# EAGLE schematic 00A-023 FRDM Protoboard (EAGLE 6.3)

## Sheet 1 of 2
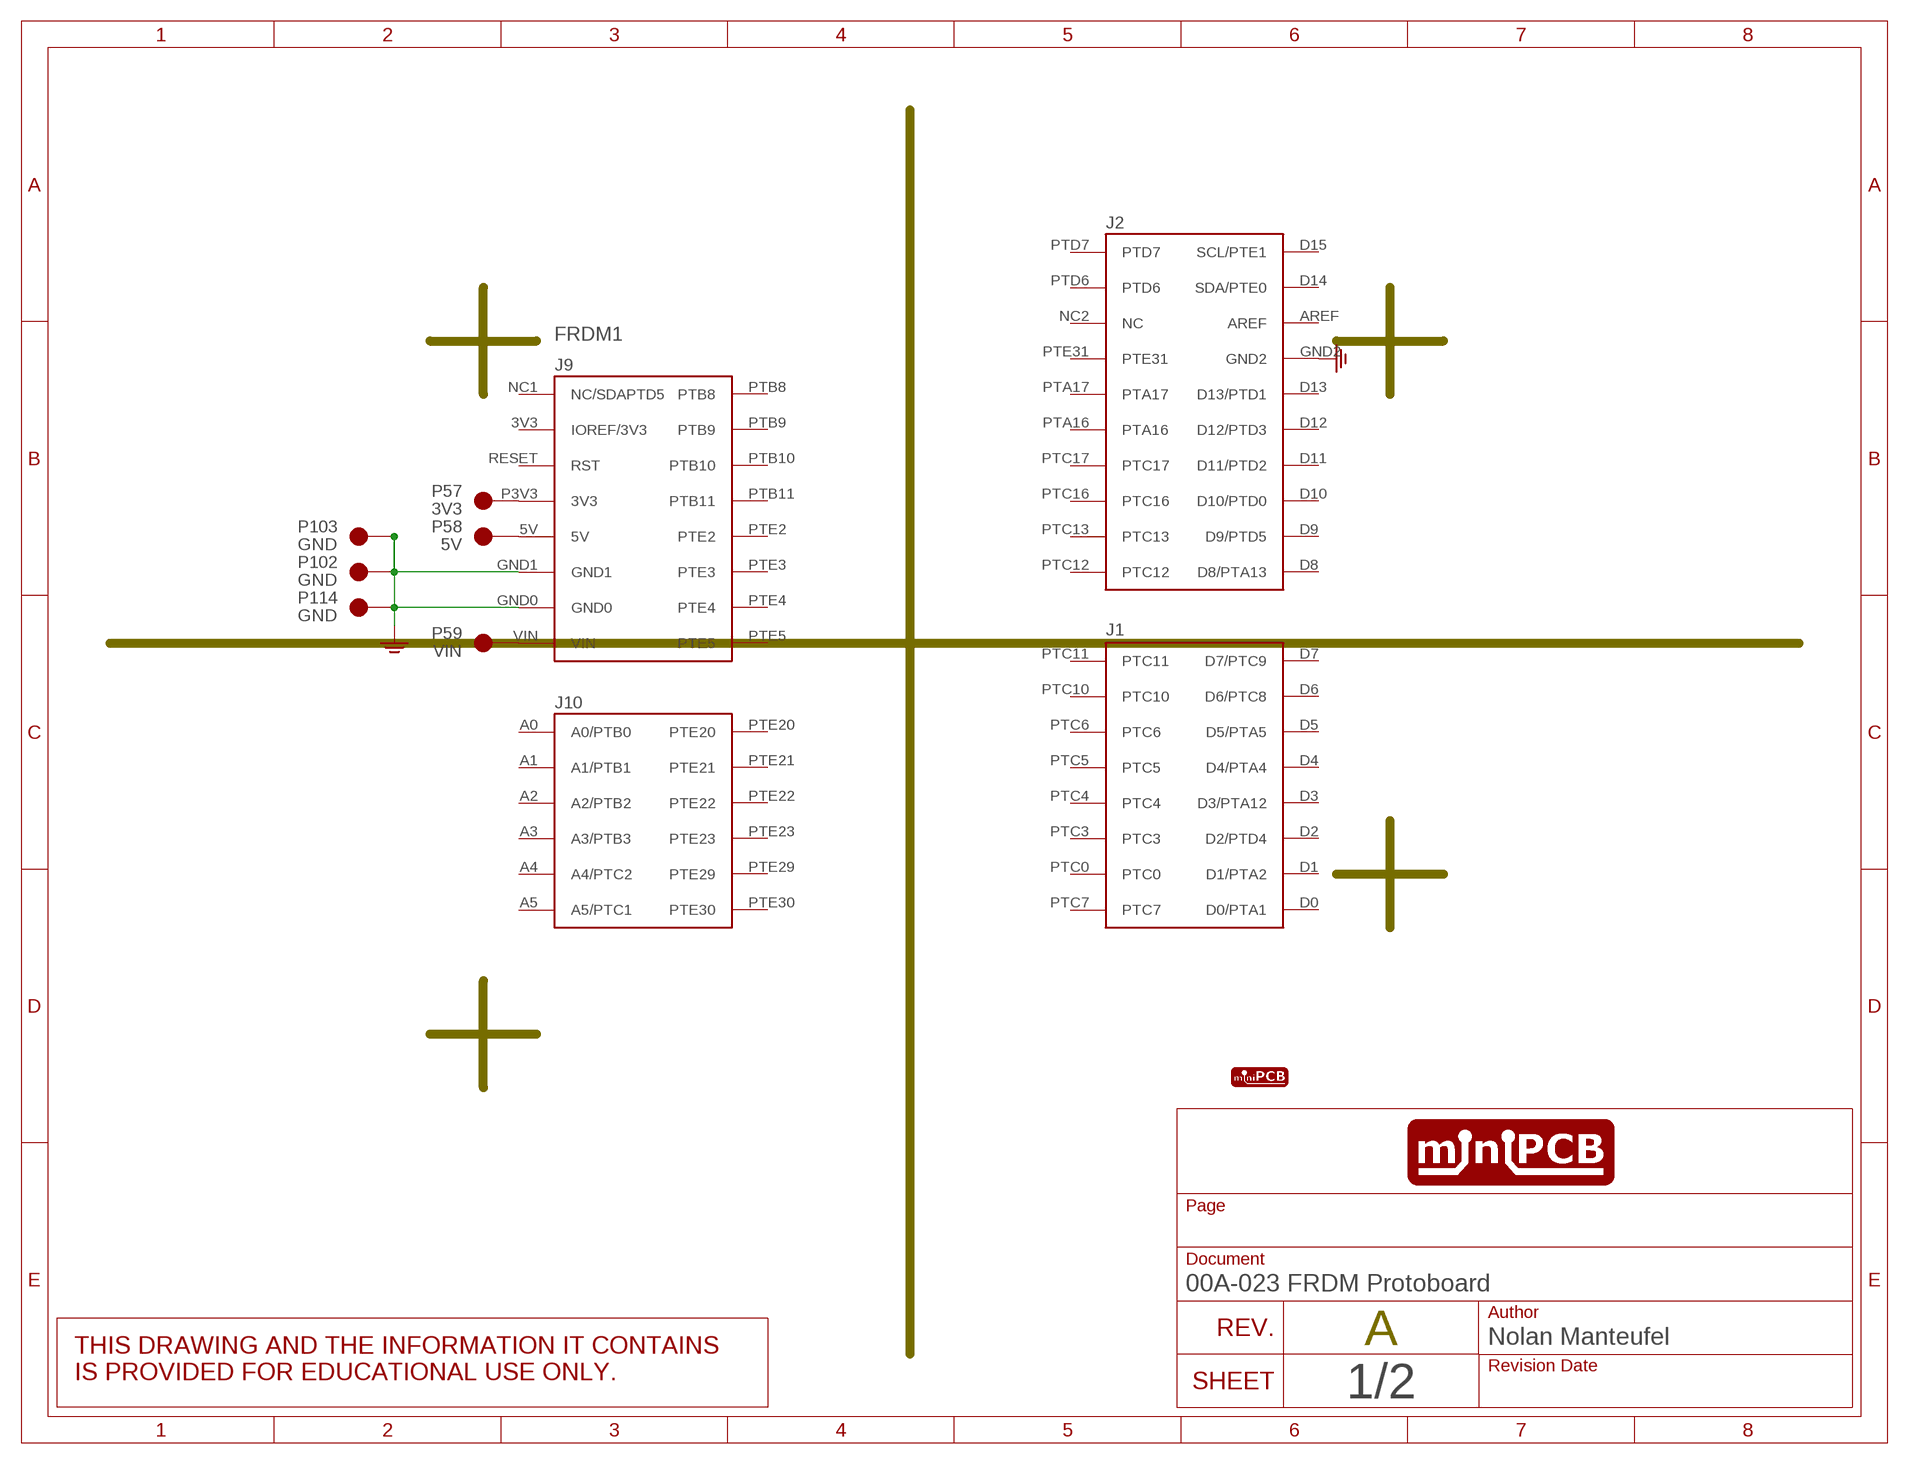
[diagram p0: schematic, sheet 1]

### Parts
FRDM1  FRDM-KL25ZNORMAL  [FRDM_KL25Z_NORMAL]
P57  3V3  PINS_13P_VALUE  [PINS_1-3P_VALUE]
P58  5V  PINS_13P_VALUE  [PINS_1-3P_VALUE]
P59  VIN  PINS_13P_VALUE  [PINS_1-3P_VALUE]
P102  GND  PINS_13P_VALUE  [PINS_1-3P_VALUE]
P103  GND  PINS_13P_VALUE  [PINS_1-3P_VALUE]
P114  GND  PINS_13P_VALUE  [PINS_1-3P_VALUE]
U$1  MINIPCB_LOGO  [MINIPCB-LOGO]

### Nets
GND: FRDM1.GND0 FRDM1.GND1 FRDM1.GND2 P102.1 P102.2 P102.3 P103.1 P103.2 P103.3 P114.1 P114.2 P114.3
N$57: FRDM1.P3V3(3V3) P57.1 P57.2 P57.3
N$58: FRDM1.5V P58.1 P58.2 P58.3
N$59: FRDM1.VIN P59.1 P59.2 P59.3
Unconnected: FRDM1.3V3(IOREF/3V3) FRDM1.A0(A0/PTB0) FRDM1.A1(A1/PTB1) FRDM1.A2(A2/PTB2) FRDM1.A3(A3/PTB3) FRDM1.A4(A4/PTC2) FRDM1.A5(A5/PTC1) FRDM1.AREF FRDM1.D0(D0/PTA1) FRDM1.D1(D1/PTA2) FRDM1.D2(D2/PTD4) FRDM1.D3(D3/PTA12) FRDM1.D4(D4/PTA4) FRDM1.D5(D5/PTA5) FRDM1.D6(D6/PTC8) FRDM1.D7(D7/PTC9) FRDM1.D8(D8/PTA13) FRDM1.D9(D9/PTD5) FRDM1.D10(D10/PTD0) FRDM1.D11(D11/PTD2) FRDM1.D12(D12/PTD3) FRDM1.D13(D13/PTD1) FRDM1.D14(SDA/PTE0) FRDM1.D15(SCL/PTE1) FRDM1.NC1(NC/SDAPTD5) FRDM1.NC2(NC) FRDM1.PTA16 FRDM1.PTA17 FRDM1.PTB8 FRDM1.PTB9 FRDM1.PTB10 FRDM1.PTB11 FRDM1.PTC0 FRDM1.PTC3 FRDM1.PTC4 FRDM1.PTC5 FRDM1.PTC6 FRDM1.PTC7 FRDM1.PTC10 FRDM1.PTC11 FRDM1.PTC12 FRDM1.PTC13 FRDM1.PTC16 FRDM1.PTC17 FRDM1.PTD6 FRDM1.PTD7 FRDM1.PTE2 FRDM1.PTE3 FRDM1.PTE4 FRDM1.PTE5 FRDM1.PTE20 FRDM1.PTE21 FRDM1.PTE22 FRDM1.PTE23 FRDM1.PTE29 FRDM1.PTE30 FRDM1.PTE31 FRDM1.RESET(RST)

## Sheet 2 of 2
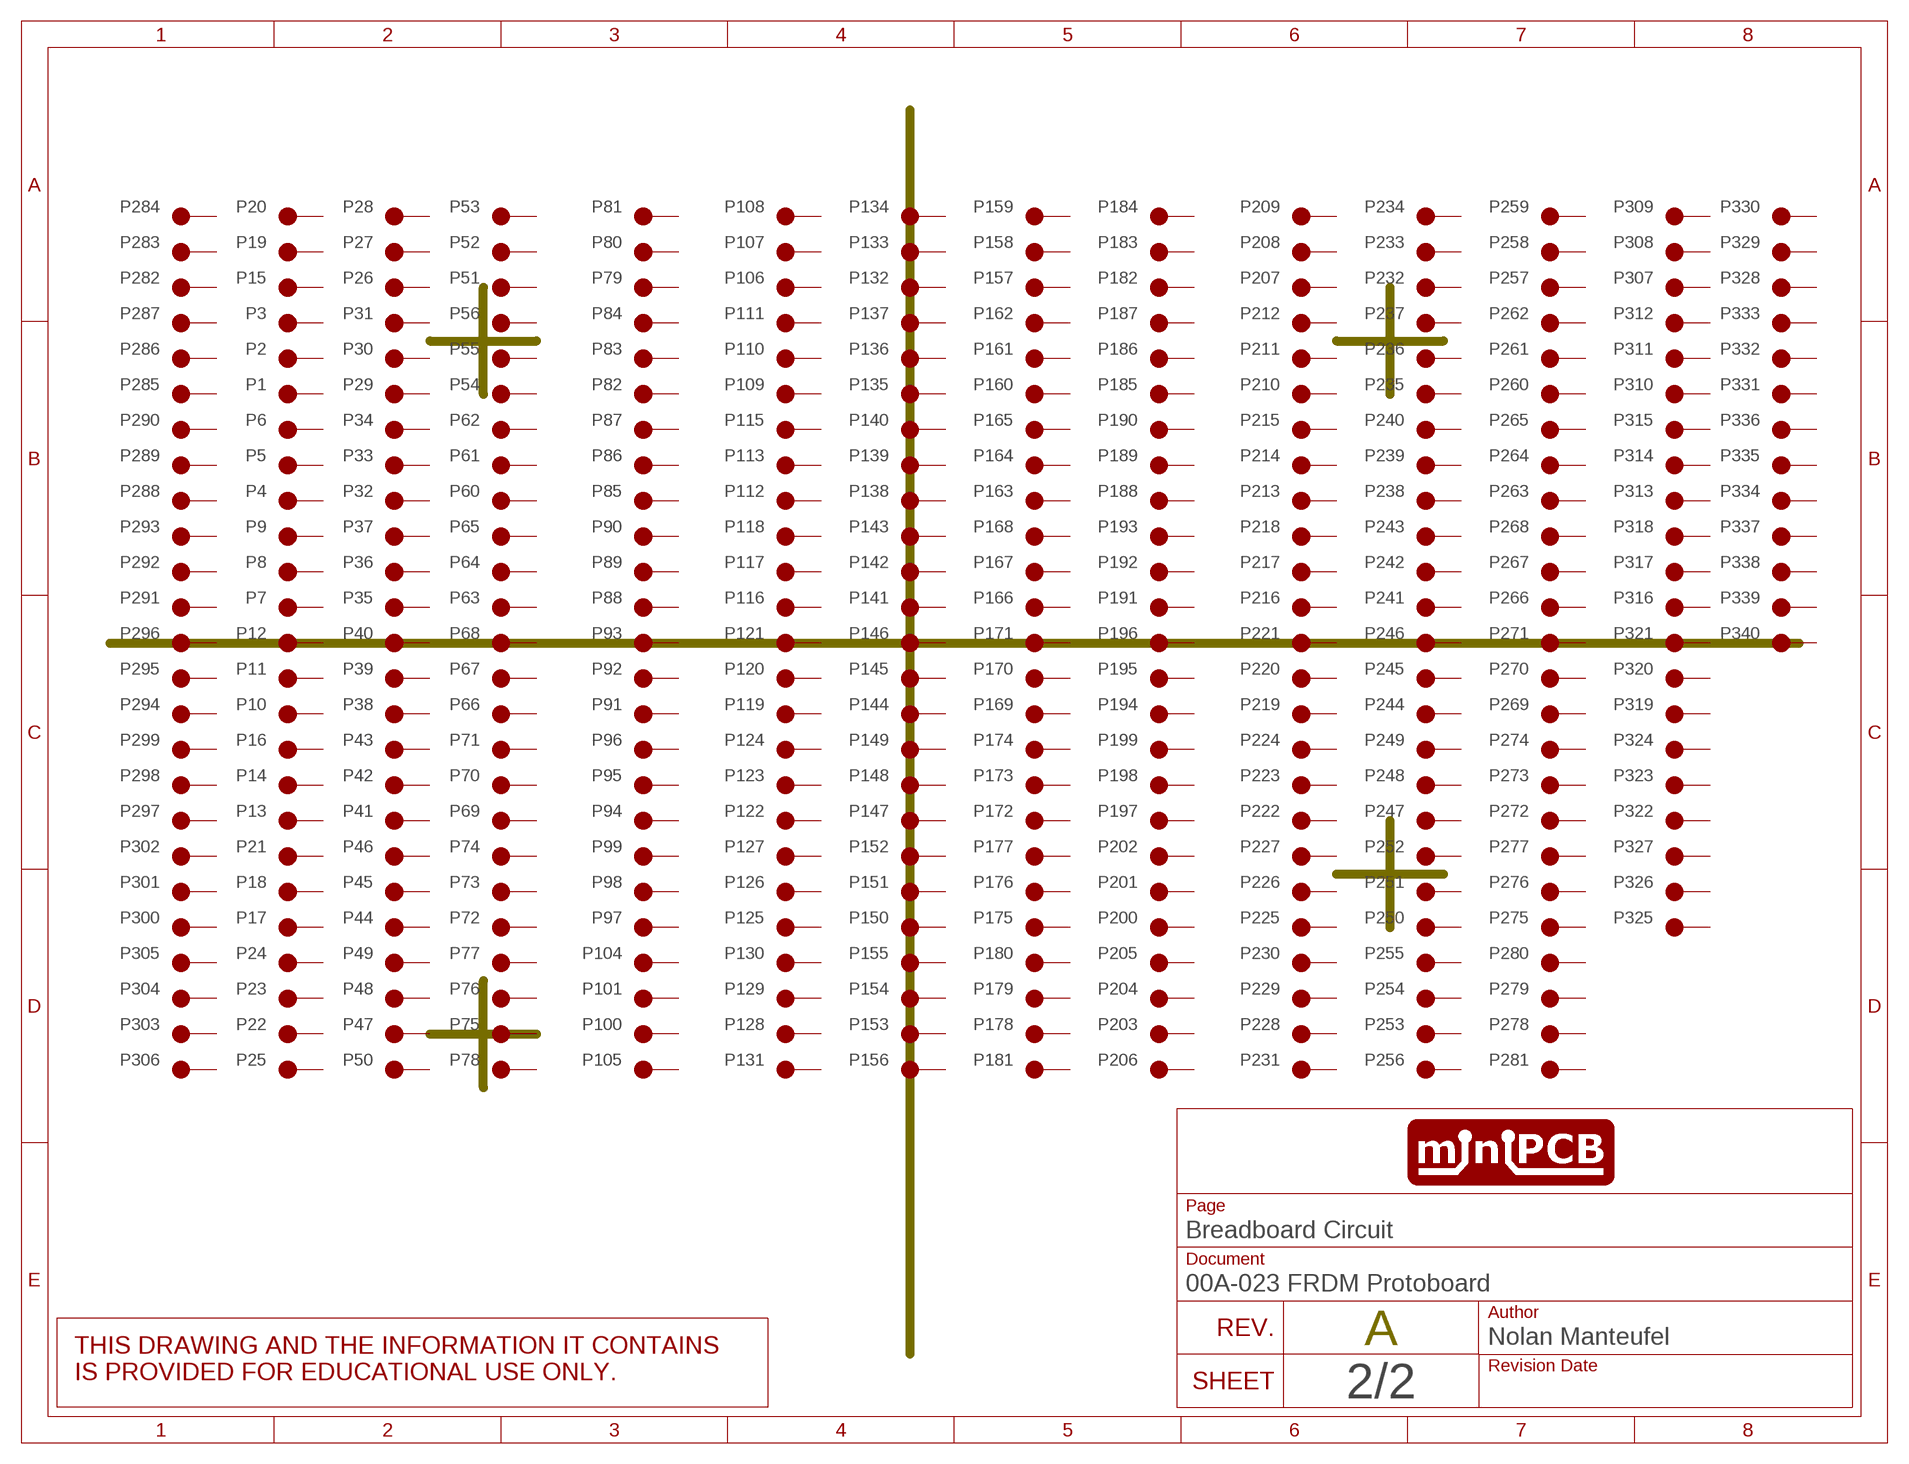
[diagram p1: schematic, sheet 2]

### Parts
P1  PINS_11P_VALUE  [PINS_1-1P_VALUE]
P2  PINS_11P_VALUE  [PINS_1-1P_VALUE]
P3  PINS_11P_VALUE  [PINS_1-1P_VALUE]
P4  PINS_11P_VALUE  [PINS_1-1P_VALUE]
P5  PINS_11P_VALUE  [PINS_1-1P_VALUE]
P6  PINS_11P_VALUE  [PINS_1-1P_VALUE]
P7  PINS_11P_VALUE  [PINS_1-1P_VALUE]
P8  PINS_11P_VALUE  [PINS_1-1P_VALUE]
P9  PINS_11P_VALUE  [PINS_1-1P_VALUE]
P10  PINS_11P_VALUE  [PINS_1-1P_VALUE]
P11  PINS_11P_VALUE  [PINS_1-1P_VALUE]
P12  PINS_11P_VALUE  [PINS_1-1P_VALUE]
P13  PINS_11P_VALUE  [PINS_1-1P_VALUE]
P14  PINS_11P_VALUE  [PINS_1-1P_VALUE]
P15  PINS_11P_VALUE  [PINS_1-1P_VALUE]
P16  PINS_11P_VALUE  [PINS_1-1P_VALUE]
P17  PINS_11P_VALUE  [PINS_1-1P_VALUE]
P18  PINS_11P_VALUE  [PINS_1-1P_VALUE]
P19  PINS_11P_VALUE  [PINS_1-1P_VALUE]
P20  PINS_11P_VALUE  [PINS_1-1P_VALUE]
P21  PINS_11P_VALUE  [PINS_1-1P_VALUE]
P22  PINS_11P_VALUE  [PINS_1-1P_VALUE]
P23  PINS_11P_VALUE  [PINS_1-1P_VALUE]
P24  PINS_11P_VALUE  [PINS_1-1P_VALUE]
P25  PINS_11P_VALUE  [PINS_1-1P_VALUE]
P26  PINS_11P_VALUE  [PINS_1-1P_VALUE]
P27  PINS_11P_VALUE  [PINS_1-1P_VALUE]
P28  PINS_11P_VALUE  [PINS_1-1P_VALUE]
P29  PINS_11P_VALUE  [PINS_1-1P_VALUE]
P30  PINS_11P_VALUE  [PINS_1-1P_VALUE]
P31  PINS_11P_VALUE  [PINS_1-1P_VALUE]
P32  PINS_11P_VALUE  [PINS_1-1P_VALUE]
P33  PINS_11P_VALUE  [PINS_1-1P_VALUE]
P34  PINS_11P_VALUE  [PINS_1-1P_VALUE]
P35  PINS_11P_VALUE  [PINS_1-1P_VALUE]
P36  PINS_11P_VALUE  [PINS_1-1P_VALUE]
P37  PINS_11P_VALUE  [PINS_1-1P_VALUE]
P38  PINS_11P_VALUE  [PINS_1-1P_VALUE]
P39  PINS_11P_VALUE  [PINS_1-1P_VALUE]
P40  PINS_11P_VALUE  [PINS_1-1P_VALUE]
P41  PINS_11P_VALUE  [PINS_1-1P_VALUE]
P42  PINS_11P_VALUE  [PINS_1-1P_VALUE]
P43  PINS_11P_VALUE  [PINS_1-1P_VALUE]
P44  PINS_11P_VALUE  [PINS_1-1P_VALUE]
P45  PINS_11P_VALUE  [PINS_1-1P_VALUE]
P46  PINS_11P_VALUE  [PINS_1-1P_VALUE]
P47  PINS_11P_VALUE  [PINS_1-1P_VALUE]
P48  PINS_11P_VALUE  [PINS_1-1P_VALUE]
P49  PINS_11P_VALUE  [PINS_1-1P_VALUE]
P50  PINS_11P_VALUE  [PINS_1-1P_VALUE]
P51  PINS_11P_VALUE  [PINS_1-1P_VALUE]
P52  PINS_11P_VALUE  [PINS_1-1P_VALUE]
P53  PINS_11P_VALUE  [PINS_1-1P_VALUE]
P54  PINS_11P_VALUE  [PINS_1-1P_VALUE]
P55  PINS_11P_VALUE  [PINS_1-1P_VALUE]
P56  PINS_11P_VALUE  [PINS_1-1P_VALUE]
P60  PINS_11P_VALUE  [PINS_1-1P_VALUE]
P61  PINS_11P_VALUE  [PINS_1-1P_VALUE]
P62  PINS_11P_VALUE  [PINS_1-1P_VALUE]
P63  PINS_11P_VALUE  [PINS_1-1P_VALUE]
P64  PINS_11P_VALUE  [PINS_1-1P_VALUE]
P65  PINS_11P_VALUE  [PINS_1-1P_VALUE]
P66  PINS_11P_VALUE  [PINS_1-1P_VALUE]
P67  PINS_11P_VALUE  [PINS_1-1P_VALUE]
P68  PINS_11P_VALUE  [PINS_1-1P_VALUE]
P69  PINS_11P_VALUE  [PINS_1-1P_VALUE]
P70  PINS_11P_VALUE  [PINS_1-1P_VALUE]
P71  PINS_11P_VALUE  [PINS_1-1P_VALUE]
P72  PINS_11P_VALUE  [PINS_1-1P_VALUE]
P73  PINS_11P_VALUE  [PINS_1-1P_VALUE]
P74  PINS_11P_VALUE  [PINS_1-1P_VALUE]
P75  PINS_11P_VALUE  [PINS_1-1P_VALUE]
P76  PINS_11P_VALUE  [PINS_1-1P_VALUE]
P77  PINS_11P_VALUE  [PINS_1-1P_VALUE]
P78  PINS_11P_VALUE  [PINS_1-1P_VALUE]
P79  PINS_11P_VALUE  [PINS_1-1P_VALUE]
P80  PINS_11P_VALUE  [PINS_1-1P_VALUE]
P81  PINS_11P_VALUE  [PINS_1-1P_VALUE]
P82  PINS_11P_VALUE  [PINS_1-1P_VALUE]
P83  PINS_11P_VALUE  [PINS_1-1P_VALUE]
P84  PINS_11P_VALUE  [PINS_1-1P_VALUE]
P85  PINS_11P_VALUE  [PINS_1-1P_VALUE]
P86  PINS_11P_VALUE  [PINS_1-1P_VALUE]
P87  PINS_11P_VALUE  [PINS_1-1P_VALUE]
P88  PINS_11P_VALUE  [PINS_1-1P_VALUE]
P89  PINS_11P_VALUE  [PINS_1-1P_VALUE]
P90  PINS_11P_VALUE  [PINS_1-1P_VALUE]
P91  PINS_11P_VALUE  [PINS_1-1P_VALUE]
P92  PINS_11P_VALUE  [PINS_1-1P_VALUE]
P93  PINS_11P_VALUE  [PINS_1-1P_VALUE]
P94  PINS_11P_VALUE  [PINS_1-1P_VALUE]
P95  PINS_11P_VALUE  [PINS_1-1P_VALUE]
P96  PINS_11P_VALUE  [PINS_1-1P_VALUE]
P97  PINS_11P_VALUE  [PINS_1-1P_VALUE]
P98  PINS_11P_VALUE  [PINS_1-1P_VALUE]
P99  PINS_11P_VALUE  [PINS_1-1P_VALUE]
P100  PINS_11P_VALUE  [PINS_1-1P_VALUE]
P101  PINS_11P_VALUE  [PINS_1-1P_VALUE]
P104  PINS_11P_VALUE  [PINS_1-1P_VALUE]
P105  PINS_11P_VALUE  [PINS_1-1P_VALUE]
P106  PINS_11P_VALUE  [PINS_1-1P_VALUE]
P107  PINS_11P_VALUE  [PINS_1-1P_VALUE]
P108  PINS_11P_VALUE  [PINS_1-1P_VALUE]
P109  PINS_11P_VALUE  [PINS_1-1P_VALUE]
P110  PINS_11P_VALUE  [PINS_1-1P_VALUE]
P111  PINS_11P_VALUE  [PINS_1-1P_VALUE]
P112  PINS_11P_VALUE  [PINS_1-1P_VALUE]
P113  PINS_11P_VALUE  [PINS_1-1P_VALUE]
P115  PINS_11P_VALUE  [PINS_1-1P_VALUE]
P116  PINS_11P_VALUE  [PINS_1-1P_VALUE]
P117  PINS_11P_VALUE  [PINS_1-1P_VALUE]
P118  PINS_11P_VALUE  [PINS_1-1P_VALUE]
P119  PINS_11P_VALUE  [PINS_1-1P_VALUE]
P120  PINS_11P_VALUE  [PINS_1-1P_VALUE]
P121  PINS_11P_VALUE  [PINS_1-1P_VALUE]
P122  PINS_11P_VALUE  [PINS_1-1P_VALUE]
P123  PINS_11P_VALUE  [PINS_1-1P_VALUE]
P124  PINS_11P_VALUE  [PINS_1-1P_VALUE]
P125  PINS_11P_VALUE  [PINS_1-1P_VALUE]
P126  PINS_11P_VALUE  [PINS_1-1P_VALUE]
P127  PINS_11P_VALUE  [PINS_1-1P_VALUE]
P128  PINS_11P_VALUE  [PINS_1-1P_VALUE]
P129  PINS_11P_VALUE  [PINS_1-1P_VALUE]
P130  PINS_11P_VALUE  [PINS_1-1P_VALUE]
P131  PINS_11P_VALUE  [PINS_1-1P_VALUE]
P132  PINS_11P_VALUE  [PINS_1-1P_VALUE]
P133  PINS_11P_VALUE  [PINS_1-1P_VALUE]
P134  PINS_11P_VALUE  [PINS_1-1P_VALUE]
P135  PINS_11P_VALUE  [PINS_1-1P_VALUE]
P136  PINS_11P_VALUE  [PINS_1-1P_VALUE]
P137  PINS_11P_VALUE  [PINS_1-1P_VALUE]
P138  PINS_11P_VALUE  [PINS_1-1P_VALUE]
P139  PINS_11P_VALUE  [PINS_1-1P_VALUE]
P140  PINS_11P_VALUE  [PINS_1-1P_VALUE]
P141  PINS_11P_VALUE  [PINS_1-1P_VALUE]
P142  PINS_11P_VALUE  [PINS_1-1P_VALUE]
P143  PINS_11P_VALUE  [PINS_1-1P_VALUE]
P144  PINS_11P_VALUE  [PINS_1-1P_VALUE]
P145  PINS_11P_VALUE  [PINS_1-1P_VALUE]
P146  PINS_11P_VALUE  [PINS_1-1P_VALUE]
P147  PINS_11P_VALUE  [PINS_1-1P_VALUE]
P148  PINS_11P_VALUE  [PINS_1-1P_VALUE]
P149  PINS_11P_VALUE  [PINS_1-1P_VALUE]
P150  PINS_11P_VALUE  [PINS_1-1P_VALUE]
P151  PINS_11P_VALUE  [PINS_1-1P_VALUE]
P152  PINS_11P_VALUE  [PINS_1-1P_VALUE]
P153  PINS_11P_VALUE  [PINS_1-1P_VALUE]
P154  PINS_11P_VALUE  [PINS_1-1P_VALUE]
P155  PINS_11P_VALUE  [PINS_1-1P_VALUE]
P156  PINS_11P_VALUE  [PINS_1-1P_VALUE]
P157  PINS_11P_VALUE  [PINS_1-1P_VALUE]
P158  PINS_11P_VALUE  [PINS_1-1P_VALUE]
P159  PINS_11P_VALUE  [PINS_1-1P_VALUE]
P160  PINS_11P_VALUE  [PINS_1-1P_VALUE]
P161  PINS_11P_VALUE  [PINS_1-1P_VALUE]
P162  PINS_11P_VALUE  [PINS_1-1P_VALUE]
P163  PINS_11P_VALUE  [PINS_1-1P_VALUE]
P164  PINS_11P_VALUE  [PINS_1-1P_VALUE]
P165  PINS_11P_VALUE  [PINS_1-1P_VALUE]
P166  PINS_11P_VALUE  [PINS_1-1P_VALUE]
P167  PINS_11P_VALUE  [PINS_1-1P_VALUE]
P168  PINS_11P_VALUE  [PINS_1-1P_VALUE]
P169  PINS_11P_VALUE  [PINS_1-1P_VALUE]
P170  PINS_11P_VALUE  [PINS_1-1P_VALUE]
P171  PINS_11P_VALUE  [PINS_1-1P_VALUE]
P172  PINS_11P_VALUE  [PINS_1-1P_VALUE]
P173  PINS_11P_VALUE  [PINS_1-1P_VALUE]
P174  PINS_11P_VALUE  [PINS_1-1P_VALUE]
P175  PINS_11P_VALUE  [PINS_1-1P_VALUE]
P176  PINS_11P_VALUE  [PINS_1-1P_VALUE]
P177  PINS_11P_VALUE  [PINS_1-1P_VALUE]
P178  PINS_11P_VALUE  [PINS_1-1P_VALUE]
P179  PINS_11P_VALUE  [PINS_1-1P_VALUE]
P180  PINS_11P_VALUE  [PINS_1-1P_VALUE]
P181  PINS_11P_VALUE  [PINS_1-1P_VALUE]
P182  PINS_11P_VALUE  [PINS_1-1P_VALUE]
P183  PINS_11P_VALUE  [PINS_1-1P_VALUE]
P184  PINS_11P_VALUE  [PINS_1-1P_VALUE]
P185  PINS_11P_VALUE  [PINS_1-1P_VALUE]
P186  PINS_11P_VALUE  [PINS_1-1P_VALUE]
P187  PINS_11P_VALUE  [PINS_1-1P_VALUE]
P188  PINS_11P_VALUE  [PINS_1-1P_VALUE]
P189  PINS_11P_VALUE  [PINS_1-1P_VALUE]
P190  PINS_11P_VALUE  [PINS_1-1P_VALUE]
P191  PINS_11P_VALUE  [PINS_1-1P_VALUE]
P192  PINS_11P_VALUE  [PINS_1-1P_VALUE]
P193  PINS_11P_VALUE  [PINS_1-1P_VALUE]
P194  PINS_11P_VALUE  [PINS_1-1P_VALUE]
P195  PINS_11P_VALUE  [PINS_1-1P_VALUE]
P196  PINS_11P_VALUE  [PINS_1-1P_VALUE]
P197  PINS_11P_VALUE  [PINS_1-1P_VALUE]
P198  PINS_11P_VALUE  [PINS_1-1P_VALUE]
P199  PINS_11P_VALUE  [PINS_1-1P_VALUE]
P200  PINS_11P_VALUE  [PINS_1-1P_VALUE]
P201  PINS_11P_VALUE  [PINS_1-1P_VALUE]
P202  PINS_11P_VALUE  [PINS_1-1P_VALUE]
P203  PINS_11P_VALUE  [PINS_1-1P_VALUE]
P204  PINS_11P_VALUE  [PINS_1-1P_VALUE]
P205  PINS_11P_VALUE  [PINS_1-1P_VALUE]
P206  PINS_11P_VALUE  [PINS_1-1P_VALUE]
P207  PINS_11P_VALUE  [PINS_1-1P_VALUE]
P208  PINS_11P_VALUE  [PINS_1-1P_VALUE]
P209  PINS_11P_VALUE  [PINS_1-1P_VALUE]
P210  PINS_11P_VALUE  [PINS_1-1P_VALUE]
P211  PINS_11P_VALUE  [PINS_1-1P_VALUE]
P212  PINS_11P_VALUE  [PINS_1-1P_VALUE]
P213  PINS_11P_VALUE  [PINS_1-1P_VALUE]
P214  PINS_11P_VALUE  [PINS_1-1P_VALUE]
P215  PINS_11P_VALUE  [PINS_1-1P_VALUE]
P216  PINS_11P_VALUE  [PINS_1-1P_VALUE]
P217  PINS_11P_VALUE  [PINS_1-1P_VALUE]
P218  PINS_11P_VALUE  [PINS_1-1P_VALUE]
P219  PINS_11P_VALUE  [PINS_1-1P_VALUE]
P220  PINS_11P_VALUE  [PINS_1-1P_VALUE]
P221  PINS_11P_VALUE  [PINS_1-1P_VALUE]
P222  PINS_11P_VALUE  [PINS_1-1P_VALUE]
P223  PINS_11P_VALUE  [PINS_1-1P_VALUE]
P224  PINS_11P_VALUE  [PINS_1-1P_VALUE]
P225  PINS_11P_VALUE  [PINS_1-1P_VALUE]
P226  PINS_11P_VALUE  [PINS_1-1P_VALUE]
P227  PINS_11P_VALUE  [PINS_1-1P_VALUE]
P228  PINS_11P_VALUE  [PINS_1-1P_VALUE]
P229  PINS_11P_VALUE  [PINS_1-1P_VALUE]
P230  PINS_11P_VALUE  [PINS_1-1P_VALUE]
P231  PINS_11P_VALUE  [PINS_1-1P_VALUE]
P232  PINS_11P_VALUE  [PINS_1-1P_VALUE]
P233  PINS_11P_VALUE  [PINS_1-1P_VALUE]
P234  PINS_11P_VALUE  [PINS_1-1P_VALUE]
P235  PINS_11P_VALUE  [PINS_1-1P_VALUE]
P236  PINS_11P_VALUE  [PINS_1-1P_VALUE]
P237  PINS_11P_VALUE  [PINS_1-1P_VALUE]
P238  PINS_11P_VALUE  [PINS_1-1P_VALUE]
P239  PINS_11P_VALUE  [PINS_1-1P_VALUE]
P240  PINS_11P_VALUE  [PINS_1-1P_VALUE]
P241  PINS_11P_VALUE  [PINS_1-1P_VALUE]
P242  PINS_11P_VALUE  [PINS_1-1P_VALUE]
P243  PINS_11P_VALUE  [PINS_1-1P_VALUE]
P244  PINS_11P_VALUE  [PINS_1-1P_VALUE]
P245  PINS_11P_VALUE  [PINS_1-1P_VALUE]
P246  PINS_11P_VALUE  [PINS_1-1P_VALUE]
P247  PINS_11P_VALUE  [PINS_1-1P_VALUE]
P248  PINS_11P_VALUE  [PINS_1-1P_VALUE]
P249  PINS_11P_VALUE  [PINS_1-1P_VALUE]
P250  PINS_11P_VALUE  [PINS_1-1P_VALUE]
P251  PINS_11P_VALUE  [PINS_1-1P_VALUE]
P252  PINS_11P_VALUE  [PINS_1-1P_VALUE]
P253  PINS_11P_VALUE  [PINS_1-1P_VALUE]
P254  PINS_11P_VALUE  [PINS_1-1P_VALUE]
P255  PINS_11P_VALUE  [PINS_1-1P_VALUE]
P256  PINS_11P_VALUE  [PINS_1-1P_VALUE]
P257  PINS_11P_VALUE  [PINS_1-1P_VALUE]
P258  PINS_11P_VALUE  [PINS_1-1P_VALUE]
P259  PINS_11P_VALUE  [PINS_1-1P_VALUE]
P260  PINS_11P_VALUE  [PINS_1-1P_VALUE]
P261  PINS_11P_VALUE  [PINS_1-1P_VALUE]
P262  PINS_11P_VALUE  [PINS_1-1P_VALUE]
P263  PINS_11P_VALUE  [PINS_1-1P_VALUE]
P264  PINS_11P_VALUE  [PINS_1-1P_VALUE]
P265  PINS_11P_VALUE  [PINS_1-1P_VALUE]
P266  PINS_11P_VALUE  [PINS_1-1P_VALUE]
P267  PINS_11P_VALUE  [PINS_1-1P_VALUE]
P268  PINS_11P_VALUE  [PINS_1-1P_VALUE]
P269  PINS_11P_VALUE  [PINS_1-1P_VALUE]
P270  PINS_11P_VALUE  [PINS_1-1P_VALUE]
P271  PINS_11P_VALUE  [PINS_1-1P_VALUE]
P272  PINS_11P_VALUE  [PINS_1-1P_VALUE]
P273  PINS_11P_VALUE  [PINS_1-1P_VALUE]
P274  PINS_11P_VALUE  [PINS_1-1P_VALUE]
P275  PINS_11P_VALUE  [PINS_1-1P_VALUE]
P276  PINS_11P_VALUE  [PINS_1-1P_VALUE]
P277  PINS_11P_VALUE  [PINS_1-1P_VALUE]
P278  PINS_11P_VALUE  [PINS_1-1P_VALUE]
P279  PINS_11P_VALUE  [PINS_1-1P_VALUE]
P280  PINS_11P_VALUE  [PINS_1-1P_VALUE]
P281  PINS_11P_VALUE  [PINS_1-1P_VALUE]
P282  PINS_11P_VALUE  [PINS_1-1P_VALUE]
P283  PINS_11P_VALUE  [PINS_1-1P_VALUE]
P284  PINS_11P_VALUE  [PINS_1-1P_VALUE]
P285  PINS_11P_VALUE  [PINS_1-1P_VALUE]
P286  PINS_11P_VALUE  [PINS_1-1P_VALUE]
P287  PINS_11P_VALUE  [PINS_1-1P_VALUE]
P288  PINS_11P_VALUE  [PINS_1-1P_VALUE]
P289  PINS_11P_VALUE  [PINS_1-1P_VALUE]
P290  PINS_11P_VALUE  [PINS_1-1P_VALUE]
P291  PINS_11P_VALUE  [PINS_1-1P_VALUE]
P292  PINS_11P_VALUE  [PINS_1-1P_VALUE]
P293  PINS_11P_VALUE  [PINS_1-1P_VALUE]
P294  PINS_11P_VALUE  [PINS_1-1P_VALUE]
P295  PINS_11P_VALUE  [PINS_1-1P_VALUE]
P296  PINS_11P_VALUE  [PINS_1-1P_VALUE]
P297  PINS_11P_VALUE  [PINS_1-1P_VALUE]
P298  PINS_11P_VALUE  [PINS_1-1P_VALUE]
P299  PINS_11P_VALUE  [PINS_1-1P_VALUE]
P300  PINS_11P_VALUE  [PINS_1-1P_VALUE]
P301  PINS_11P_VALUE  [PINS_1-1P_VALUE]
P302  PINS_11P_VALUE  [PINS_1-1P_VALUE]
P303  PINS_11P_VALUE  [PINS_1-1P_VALUE]
P304  PINS_11P_VALUE  [PINS_1-1P_VALUE]
P305  PINS_11P_VALUE  [PINS_1-1P_VALUE]
P306  PINS_11P_VALUE  [PINS_1-1P_VALUE]
P307  PINS_11P_VALUE  [PINS_1-1P_VALUE]
P308  PINS_11P_VALUE  [PINS_1-1P_VALUE]
P309  PINS_11P_VALUE  [PINS_1-1P_VALUE]
P310  PINS_11P_VALUE  [PINS_1-1P_VALUE]
P311  PINS_11P_VALUE  [PINS_1-1P_VALUE]
P312  PINS_11P_VALUE  [PINS_1-1P_VALUE]
P313  PINS_11P_VALUE  [PINS_1-1P_VALUE]
P314  PINS_11P_VALUE  [PINS_1-1P_VALUE]
P315  PINS_11P_VALUE  [PINS_1-1P_VALUE]
P316  PINS_11P_VALUE  [PINS_1-1P_VALUE]
P317  PINS_11P_VALUE  [PINS_1-1P_VALUE]
P318  PINS_11P_VALUE  [PINS_1-1P_VALUE]
P319  PINS_11P_VALUE  [PINS_1-1P_VALUE]
P320  PINS_11P_VALUE  [PINS_1-1P_VALUE]
P321  PINS_11P_VALUE  [PINS_1-1P_VALUE]
P322  PINS_11P_VALUE  [PINS_1-1P_VALUE]
P323  PINS_11P_VALUE  [PINS_1-1P_VALUE]
P324  PINS_11P_VALUE  [PINS_1-1P_VALUE]
P325  PINS_11P_VALUE  [PINS_1-1P_VALUE]
P326  PINS_11P_VALUE  [PINS_1-1P_VALUE]
P327  PINS_11P_VALUE  [PINS_1-1P_VALUE]
P328  PINS_11P_VALUE  [PINS_1-1P_VALUE]
P329  PINS_11P_VALUE  [PINS_1-1P_VALUE]
P330  PINS_11P_VALUE  [PINS_1-1P_VALUE]
P331  PINS_11P_VALUE  [PINS_1-1P_VALUE]
P332  PINS_11P_VALUE  [PINS_1-1P_VALUE]
P333  PINS_11P_VALUE  [PINS_1-1P_VALUE]
P334  PINS_11P_VALUE  [PINS_1-1P_VALUE]
P335  PINS_11P_VALUE  [PINS_1-1P_VALUE]
P336  PINS_11P_VALUE  [PINS_1-1P_VALUE]
P337  PINS_11P_VALUE  [PINS_1-1P_VALUE]
P338  PINS_11P_VALUE  [PINS_1-1P_VALUE]
P339  PINS_11P_VALUE  [PINS_1-1P_VALUE]
P340  PINS_11P_VALUE  [PINS_1-1P_VALUE]
Unconnected: P1.1 P2.1 P3.1 P4.1 P5.1 P6.1 P7.1 P8.1 P9.1 P10.1 P11.1 P12.1 P13.1 P14.1 P15.1 P16.1 P17.1 P18.1 P19.1 P20.1 P21.1 P22.1 P23.1 P24.1 P25.1 P26.1 P27.1 P28.1 P29.1 P30.1 P31.1 P32.1 P33.1 P34.1 P35.1 P36.1 P37.1 P38.1 P39.1 P40.1 P41.1 P42.1 P43.1 P44.1 P45.1 P46.1 P47.1 P48.1 P49.1 P50.1 P51.1 P52.1 P53.1 P54.1 P55.1 P56.1 P60.1 P61.1 P62.1 P63.1 P64.1 P65.1 P66.1 P67.1 P68.1 P69.1 P70.1 P71.1 P72.1 P73.1 P74.1 P75.1 P76.1 P77.1 P78.1 P79.1 P80.1 P81.1 P82.1 P83.1 P84.1 P85.1 P86.1 P87.1 P88.1 P89.1 P90.1 P91.1 P92.1 P93.1 P94.1 P95.1 P96.1 P97.1 P98.1 P99.1 P100.1 P101.1 P104.1 P105.1 P106.1 P107.1 P108.1 P109.1 P110.1 P111.1 P112.1 P113.1 P115.1 P116.1 P117.1 P118.1 P119.1 P120.1 P121.1 P122.1 P123.1 P124.1 P125.1 P126.1 P127.1 P128.1 P129.1 P130.1 P131.1 P132.1 P133.1 P134.1 P135.1 P136.1 P137.1 P138.1 P139.1 P140.1 P141.1 P142.1 P143.1 P144.1 P145.1 P146.1 P147.1 P148.1 P149.1 P150.1 P151.1 P152.1 P153.1 P154.1 P155.1 P156.1 P157.1 P158.1 P159.1 P160.1 P161.1 P162.1 P163.1 P164.1 P165.1 P166.1 P167.1 P168.1 P169.1 P170.1 P171.1 P172.1 P173.1 P174.1 P175.1 P176.1 P177.1 P178.1 P179.1 P180.1 P181.1 P182.1 P183.1 P184.1 P185.1 P186.1 P187.1 P188.1 P189.1 P190.1 P191.1 P192.1 P193.1 P194.1 P195.1 P196.1 P197.1 P198.1 P199.1 P200.1 P201.1 P202.1 P203.1 P204.1 P205.1 P206.1 P207.1 P208.1 P209.1 P210.1 P211.1 P212.1 P213.1 P214.1 P215.1 P216.1 P217.1 P218.1 P219.1 P220.1 P221.1 P222.1 P223.1 P224.1 P225.1 P226.1 P227.1 P228.1 P229.1 P230.1 P231.1 P232.1 P233.1 P234.1 P235.1 P236.1 P237.1 P238.1 P239.1 P240.1 P241.1 P242.1 P243.1 P244.1 P245.1 P246.1 P247.1 P248.1 P249.1 P250.1 P251.1 P252.1 P253.1 P254.1 P255.1 P256.1 P257.1 P258.1 P259.1 P260.1 P261.1 P262.1 P263.1 P264.1 P265.1 P266.1 P267.1 P268.1 P269.1 P270.1 P271.1 P272.1 P273.1 P274.1 P275.1 P276.1 P277.1 P278.1 P279.1 P280.1 P281.1 P282.1 P283.1 P284.1 P285.1 P286.1 P287.1 P288.1 P289.1 P290.1 P291.1 P292.1 P293.1 P294.1 P295.1 P296.1 P297.1 P298.1 P299.1 P300.1 P301.1 P302.1 P303.1 P304.1 P305.1 P306.1 P307.1 P308.1 P309.1 P310.1 P311.1 P312.1 P313.1 P314.1 P315.1 P316.1 P317.1 P318.1 P319.1 P320.1 P321.1 P322.1 P323.1 P324.1 P325.1 P326.1 P327.1 P328.1 P329.1 P330.1 P331.1 P332.1 P333.1 P334.1 P335.1 P336.1 P337.1 P338.1 P339.1 P340.1

## Library data of the parts
FRDM1 = nolan:FRDM-KL25Z: For creating FRDM-KL25Z shields Check prices <https://pricing.snapeda.com/parts/FRDM-KL25Z/NXP%20USA/view-part?ref=eda>; AVAILABILITY: In Stock; DESCRIPTION: KL1x, KL2x, mbed-Enabled Development Freedom Kinetis ARM® Cortex®-M0+ MCU 32-Bit Embedded Evaluation Board; MF: NXP USA; MP: FRDM-KL25Z; PACKAGE: 0805 Freescale Semiconductor; PRICE: None; PURCHASE-URL: https://pricing.snapeda.com/search/part/FRDM-KL25Z/?ref=eda
P1-P340 = nolan:PINS_1
U$1 = nolan:MINIPCB_LOGO